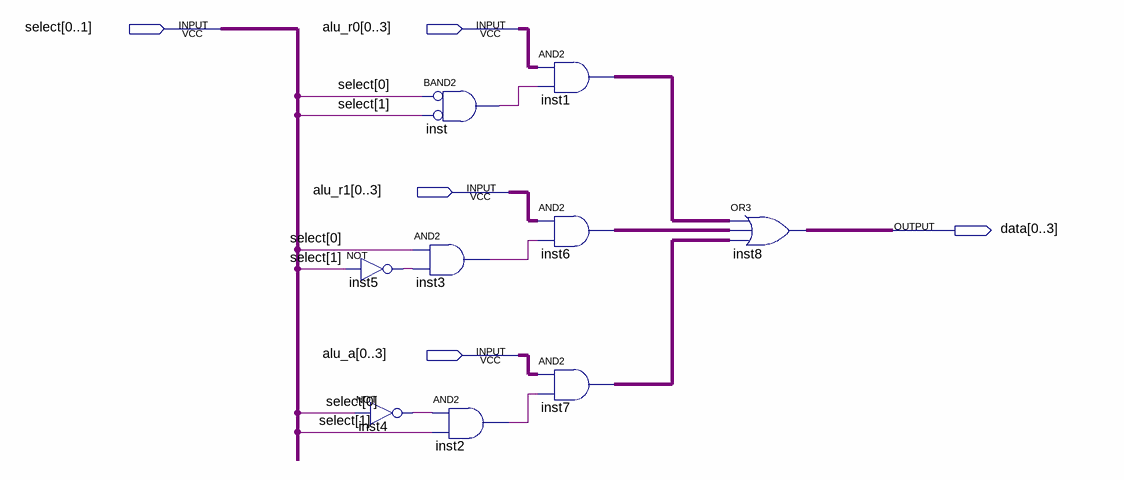
[diagram p0: schematic sheet]
// Quartus schematic mul_mux.bdf as structural Verilog: 9 symbols, 5 pins
module mul_mux (
  input  [0:1] select,
  input  [0:3] alu_r0,
  input  [0:3] alu_r1,
  input  [0:3] alu_a,
  output [0:3] data
);

  wire inst2_out, inst3_out, inst4_out, inst5_out, inst_out;
  wire [3:0] inst1_out, inst6_out, inst7_out;

  not inst5 (inst5_out, select[1]);
  not inst4 (inst4_out, select[0]);
  and inst (inst_out, ~select[0], ~select[1]);  // BAND2
  and inst3 (inst3_out, select[0], inst5_out);
  and inst2 (inst2_out, inst4_out, select[1]);
  assign inst1_out = alu_r0 & {4{inst_out}};  // AND2 inst1, 4 bits wide
  assign inst6_out = alu_r1 & {4{inst3_out}};  // AND2 inst6, 4 bits wide
  assign inst7_out = alu_a & {4{inst2_out}};  // AND2 inst7, 4 bits wide
  assign data = inst1_out | inst6_out | inst7_out;  // OR3 inst8, 4 bits wide
endmodule
